# Altium schematic sheet boost şematik.SchDoc
size A3; SheetNumber: 1; SheetTotal: 1
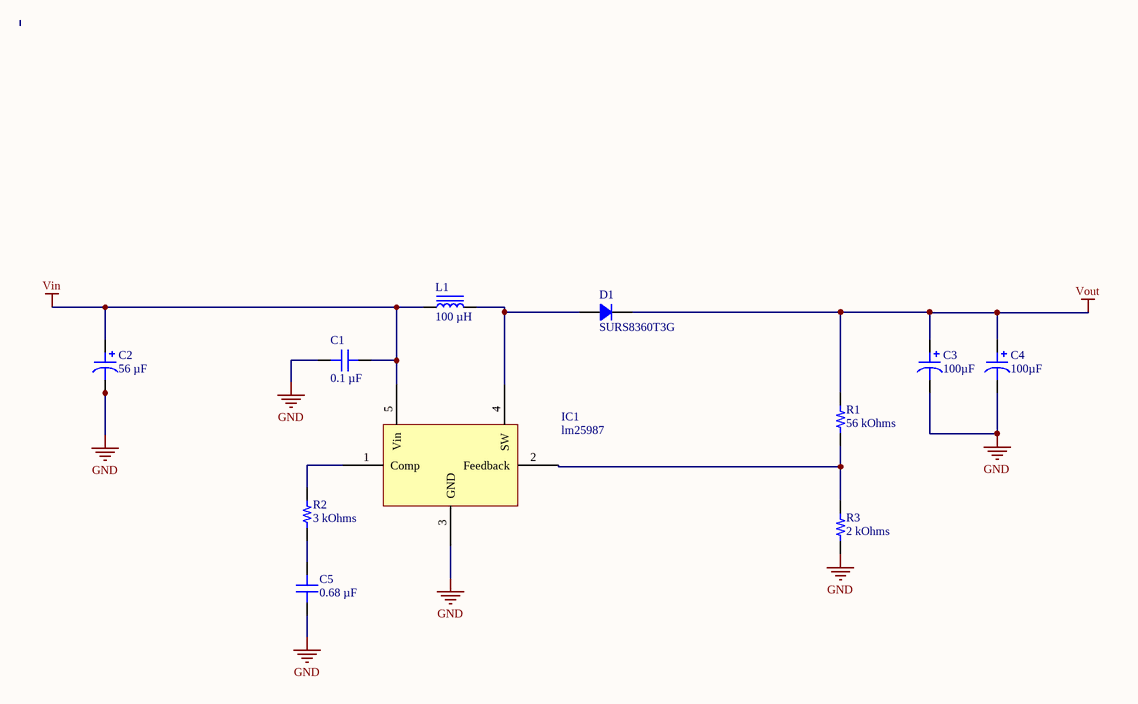
[diagram p0: boost şematik.SchDoc]

## Parts
C1  0.1 µF  [CAP 0805_2012]
C2  56 µF  [CAP ALSMD 6.6MM H7.7MM]
C3  100µF  [CAP ALSMD 8.3MM H10.5MM]
C4  100µF  [CAP ALSMD 8.3MM H10.5MM]
C5  0.68 µF  [CAP 0805_2012]
D1  SURS8360T3G  [DO214AB SMC]
IC1  lm25987  [LM2596 FOOTPRİNT]
L1  100 µH  [7447070 bobin]
R1  56 kOhms  [RES 0805_2012]
R2  3 kOhms  [RES 0805_2012]
R3  2 kOhms  [RES 0805_2012]

## Nets
GND: C1.2 C2.2 C3.2 C4.2 C5.1 IC1.3(GND) R3.1
Vin: C1.1 C2.1 IC1.5(Vin) L1.1
Vout: C3.1 C4.1 D1.2 R1.2
NetC5_2: C5.2 R2.1
NetD1_1: D1.1 IC1.4(SW) L1.2
NetIC1_1: IC1.1(Comp) R2.2
NetIC1_2: IC1.2(Feedback) R1.1 R3.2

## Library data of the parts
C1 = CC0805MRX7R9BB104: CAP CER 0.1UF 50V X7R 0805; manufacturer: Yageo; Tolerance: ±20%; Part Number: CC0805MRX7R9BB104; Value: 0.1 µF; Applications: General Purpose; Capacitance: 0.1 µF; componentlink1description: Datasheet; componentlink1url: https://www.yageo.com/upload/media/product/productsearch/datasheet/mlcc/UPY-GPHC_X7R_6.3V-to-50V_18.pdf; componentlink2description: DigiKey Link; componentlink2url: https://www.digikey.com/en/products/detail/yageo/CC0805MRX7R9BB104/5884281; Device Package: 0805 (2012 Metric); lastupdated: 14.8.2022 21:13:15; Lifecycle Status: Active; Minimum Order: 1; Mounting Type: Surface Mount, MLCC; Operating Temperature: -55°C ~ 125°C; Package / Case: 0805 (2012 Metric); packaging: TapeAndReel; partid: 2475; Part Status: Active; price: 0.02; series: CC; Size / Dimension: 0.079" L x 0.049" W (2.00mm x 1.25mm); Supplier 1: DigiKey; Supplier Part Number 1: 311-4351-1-ND; Temperature Coefficient: X7R; Thickness (Max): 0.037" (0.95mm); Voltage - Rated: 50V
C2 = UUD1V560MCL1GS: CAP ALUM 56UF 20% 35V SMD; manufacturer: Nichicon; Impedance: 340 mOhms; Lifetime @ Temp.: 2000 Hrs @ 105°C; Polarization: Polar; Ripple Current @ High Frequency: 280 mA @ 100 kHz; Ripple Current @ Low Frequency: 140 mA @ 120 Hz; Surface Mount Land Size: 0.260" L x 0.260" W (6.60mm x 6.60mm); Part Number: UUD1V560MCL1GS; Applications: Automotive; Capacitance: 56 µF; componentlink1description: Datasheet; componentlink1url: http://nichicon-us.com/english/products/pdfs/e-uud.pdf; componentlink2description: DigiKey Link; componentlink2url: https://www.digikey.com/en/products/detail/nichicon/UUD1V560MCL1GS/590029; Device Package: Radial, Can - SMD; Height - Seated (Max): 0.303" (7.70mm); lastupdated: 14.8.2022 22:06:55; Lifecycle Status: Active; Minimum Order: 1; Mounting Type: Surface Mount; Operating Temperature: -55°C ~ 105°C; Package / Case: Radial, Can - SMD; packaging: TapeAndReel; partid: 27263; Part Status: Active; price: 0.17; Ratings: AEC-Q200; series: UUD; Size / Dimension: 0.248" Dia (6.30mm); Supplier 1: DigiKey; Supplier Part Number 1: 493-2288-1-ND; Tolerance: ±20%; value: 56 µF; Voltage - Rated: 35 V
C3 C4 = EEE-FK1H101P: CAP ALUM 100UF 20% 50V SMD; manufacturer: Panasonic Electronic Components; Impedance: 340 mOhms; Lifetime @ Temp.: 2000 Hrs @ 105°C; Polarization: Polar; Ripple Current @ High Frequency: 350mA @ 100kHz; Ripple Current @ Low Frequency: 262.5mA @ 120Hz; Surface Mount Land Size: 0.327" L x 0.327" W (8.30mm x 8.30mm); Part Number: EEE-FK1H101P; Applications: Automotive; Capacitance: 100µF; componentlink2description: DigiKey Link; componentlink2url: http://digikey.com/product-detail/en/panasonic-electronic-components/EEE-FK1H101P/PCE3809CT-ND/766185; Device Package: Radial, Can - SMD; Height - Seated (Max): 0.413" (10.50mm); lastupdated: 2.9.2020 01:25:16; Lifecycle Status: Active; Minimum Order: 1; Mounting Type: Surface Mount; Operating Temperature: -55°C ~ 105°C; Package / Case: Radial, Can - SMD; packaging: TapeAndReel; partid: 7485; Part Status: Active; price: 0.25; Ratings: AEC-Q200; series: FK; Size / Dimension: 0.315" Dia (8.00mm); Supplier 1: DigiKey; Supplier Part Number 1: PCE3809CT-ND; Tolerance: ±20%; value: 100µF; Voltage - Rated: 50V
C5 = C0805C684K5RACAUTO: CAP CER 0.68UF 50V X7R 0805; manufacturer: KEMET; Tolerance: ±10%; Part Number: C0805C684K5RACAUTO; Value: 0.68 µF; Applications: Automotive, Bypass, Decoupling; Capacitance: 0.68 µF; componentlink1description: Datasheet; componentlink1url: https://api.kemet.com/component-edge/download/datasheet/C0805C684K5RACAUTO.pdf; componentlink2description: DigiKey Link; componentlink2url: https://www.digikey.com/en/products/detail/kemet/C0805C684K5RACAUTO/7516138; Device Package: 0805 (2012 Metric); lastupdated: 14.8.2022 21:12:36; Lifecycle Status: Active; Minimum Order: 1; Mounting Type: Surface Mount, MLCC; Operating Temperature: -55°C ~ 125°C; Package / Case: 0805 (2012 Metric); packaging: TapeAndReel; partid: 15110; Part Status: Active; price: 0.06; Ratings: AEC-Q200; series: SMD Auto X7R; Size / Dimension: 0.079" L x 0.049" W (2.00mm x 1.25mm); Supplier 1: DigiKey; Supplier Part Number 1: 399-15904-1-ND; Temperature Coefficient: X7R; Thickness (Max): 0.057" (1.45mm); Voltage - Rated: 50V
D1 = SURS8360T3G: DIODE GEN PURP 600V 3A SMC; Manufacturer: ON Semiconductor; Current - Reverse Leakage @ Vr: 10µA @ 600V; Diode Type: Standard; Reverse Recovery Time (trr): 75ns; Speed: Fast Recovery =< 500ns, > 200mA (Io); Voltage - Forward (Vf) (Max) @ If: 1.25V @ 3A; Part Number: SURS8360T3G; ComponentLink1Description: Datasheet; ComponentLink1URL: http://www.onsemi.com/pub/Collateral/MURS320T3-D.PDF; ComponentLink2Description: DigiKey Link; ComponentLink2URL: http://digikey.com/product-detail/en/on-semiconductor/SURS8360T3G/SURS8360T3GOSCT-ND/9087771; Current - Average Rectified (Io): 3A; LastUpdated: 14.8.2022 21:53:44; Lifecycle Status: Active; Minimum Order: 1; Mounting Type: Surface Mount; Operating Temperature - Junction: -65°C ~ 175°C; Package / Case: DO-214AB, SMC; Packaging: TapeAndReel; PartId: 348; Part Status: Active; Price: 0.30; Series: -; Supplier 1: DigiKey; Supplier Part Number 1: SURS8360T3GOSCT-ND; Supplier Device Package: SMC; Voltage - DC Reverse (Vr) (Max): 600V
L1 = SRR1280-101M: FIXED IND 100UH 2.1A 150MOHM SMD; Manufacturer: Bourns Inc.; Current - Saturation: 2A; DC Resistance (DCR): 150mOhm Max; Frequency - Self Resonant: 4.5MHz; Inductance Frequency - Test: 100 kHz; Material - Core: Ferrite; Q @ Freq: 18 @ 796kHz; Shielding: Shielded; Tolerance: ±20%; Type: Drum Core, Wirewound; Part Number: SRR1280-101M; ComponentLink1Description: Datasheet; ComponentLink1URL: https://www.bourns.com/docs/Product-Datasheets/SRR1280.pdf; ComponentLink2Description: DigiKey Link; ComponentLink2URL: https://www.digikey.com/en/products/detail/bourns-inc/SRR1280-101M/2127044; Current Rating (Amps): 2.1 A; Device Package: Nonstandard; Height - Seated (Max): 0.315" (8.00mm); Inductance: 100 µH; LastUpdated: 14.8.2022 21:59:04; Lifecycle Status: Active; Minimum Order: 1; Mounting Type: Surface Mount; Operating Temperature: -40°C ~ 125°C; Package / Case: Nonstandard; Packaging: TapeAndReel; PartId: 24; Part Status: Active; Price: 0.55; Series: SRR1280; Size / Dimension: 0.492" L x 0.492" W (12.50mm x 12.50mm); Supplier 1: DigiKey; Supplier Part Number 1: SRR1280-101MCT-ND; Value: 100 µH
R1 = RNCF0805DTE56K0: RES 56K OHM 0.5% 1/8W 0805; Manufacturer: Stackpole Electronics Inc; Power (Watts): 0.125W, 1/8W; Temperature Coefficient: ±25ppm/°C; Part Number: RNCF0805DTE56K0; Value: 56 kOhms; ComponentLink1Description: Datasheet; ComponentLink1URL: https://www.seielect.com/catalog/sei-rncf.pdf; ComponentLink2Description: DigiKey Link; ComponentLink2URL: https://www.digikey.com/en/products/detail/stackpole-electronics-inc/RNCF0805DTE56K0/6241966; Composition: Thin Film; Device Package: 0805 (2012 Metric); Features: Automotive AEC-Q200; Height - Seated (Max): 0.026" (0.65mm); LastUpdated: 14.8.2022 21:44:14; Lifecycle Status: Active; Minimum Order: 1; Number of Terminations: 2; Operating Temperature: -55°C ~ 155°C; Package / Case: 0805 (2012 Metric); Packaging: TapeAndReel; PartId: 42907; Part Status: Active; Price: 0.02; Ratings: AEC-Q200; Resistance: 56 kOhms; Series: RNCF; Size / Dimension: 0.079" L x 0.049" W (2.00mm x 1.25mm); Supplier 1: DigiKey; Supplier Part Number 1: RNCF0805DTE56K0CT-ND; Supplier Device Package: 0805; Tolerance: ±0.5%
R2 = AC0805FR-073KL: RES SMD 3K OHM 1% 1/8W 0805; Manufacturer: Yageo; Power (Watts): 0.125W, 1/8W; Temperature Coefficient: ±100ppm/°C; Part Number: AC0805FR-073KL; Value: 3 kOhms; ComponentLink1Description: Datasheet; ComponentLink1URL: https://www.yageo.com/upload/media/product/productsearch/datasheet/rchip/PYu-AC_51_RoHS_L_7.pdf; ComponentLink2Description: DigiKey Link; ComponentLink2URL: https://www.digikey.com/en/products/detail/yageo/AC0805FR-073KL/5896818; Composition: Thick Film; Device Package: 0805 (2012 Metric); Features: Automotive AEC-Q200, Moisture Resistant; Height - Seated (Max): 0.024" (0.60mm); LastUpdated: 14.8.2022 21:44:46; Lifecycle Status: Active; Minimum Order: 1; Number of Terminations: 2; Operating Temperature: -55°C ~ 155°C; Package / Case: 0805 (2012 Metric); Packaging: TapeAndReel; PartId: 34669; Part Status: Active; Price: 0.01; Ratings: AEC-Q200; Resistance: 3 kOhms; Series: AC; Size / Dimension: 0.079" L x 0.049" W (2.00mm x 1.25mm); Supplier 1: DigiKey; Supplier Part Number 1: YAG3730CT-ND; Supplier Device Package: 0805; Tolerance: ±1%
R3 = AC0805FR-072KL: RES SMD 2K OHM 1% 1/8W 0805; Manufacturer: Yageo; Power (Watts): 0.125W, 1/8W; Temperature Coefficient: ±100ppm/°C; Part Number: AC0805FR-072KL; Value: 2 kOhms; ComponentLink1Description: Datasheet; ComponentLink1URL: https://www.yageo.com/upload/media/product/productsearch/datasheet/rchip/PYu-AC_51_RoHS_L_7.pdf; ComponentLink2Description: DigiKey Link; ComponentLink2URL: https://www.digikey.com/en/products/detail/yageo/AC0805FR-072KL/5896741; Composition: Thick Film; Device Package: 0805 (2012 Metric); Features: Automotive AEC-Q200, Moisture Resistant; Height - Seated (Max): 0.024" (0.60mm); LastUpdated: 14.8.2022 21:44:46; Lifecycle Status: Active; Minimum Order: 1; Number of Terminations: 2; Operating Temperature: -55°C ~ 155°C; Package / Case: 0805 (2012 Metric); Packaging: TapeAndReel; PartId: 34654; Part Status: Active; Price: 0.01; Ratings: AEC-Q200; Resistance: 2 kOhms; Series: AC; Size / Dimension: 0.079" L x 0.049" W (2.00mm x 1.25mm); Supplier 1: DigiKey; Supplier Part Number 1: YAG3718CT-ND; Supplier Device Package: 0805; Tolerance: ±1%